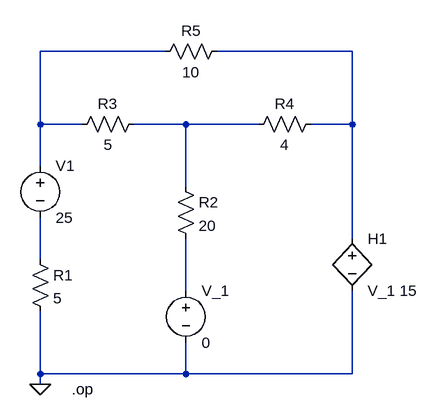
[diagram p0: schematic CH03-KP1-08.asc]
CH03-KP1-08.asc, the LTspice schematic file:
Version 4
SHEET 1 880 680
WIRE 256 64 64 64
WIRE 544 64 336 64
WIRE 64 176 64 64
WIRE 128 176 64 176
WIRE 288 176 208 176
WIRE 400 176 288 176
WIRE 544 176 544 64
WIRE 544 176 480 176
WIRE 64 240 64 176
WIRE 288 272 288 176
WIRE 544 352 544 176
WIRE 64 384 64 320
WIRE 288 432 288 352
WIRE 64 560 64 464
WIRE 288 560 288 512
WIRE 288 560 64 560
WIRE 544 560 544 432
WIRE 544 560 288 560
WIRE 64 576 64 560
FLAG 64 576 0
SYMBOL res 48 368 R0
SYMATTR InstName R1
SYMATTR Value 5
SYMBOL res 272 256 R0
SYMATTR InstName R2
SYMATTR Value 20
SYMBOL res 224 160 R90
WINDOW 0 0 56 VBottom 2
WINDOW 3 32 56 VTop 2
SYMATTR InstName R3
SYMATTR Value 5
SYMBOL res 496 160 R90
WINDOW 0 0 56 VBottom 2
WINDOW 3 32 56 VTop 2
SYMATTR InstName R4
SYMATTR Value 4
SYMBOL res 352 48 R90
WINDOW 0 0 56 VBottom 2
WINDOW 3 32 56 VTop 2
SYMATTR InstName R5
SYMATTR Value 10
SYMBOL voltage 64 224 R0
SYMATTR InstName V1
SYMATTR Value 25
SYMBOL voltage 288 416 R0
SYMATTR InstName V_1
SYMATTR Value 0
SYMBOL h 544 336 R0
SYMATTR InstName H1
SYMATTR Value V_1 15
TEXT 112 584 Left 2 !.op

The netlist it stands for:
* CH03-KP1-08.asc
R1 N004 0 5
R2 N003 N005 20
R3 N003 N001 5
R4 N002 N003 4
R5 N002 N001 10
V1 N001 N004 25
V_1 N005 0 0
H1 N002 0 V_1 15
.op
.backanno
.end